# Altium project Fastino.PrjPCB (part 5 of 6)

## Sheet Fastino_DAC_Series_Termination.SchDoc: Fastino
size 420 x 297 mm; Author: G.Kasprowicz; CompanyName: WUT ISE; DrawnBy: G.Kasprowicz; Organization: WUT ISE; Address1: PW ISE; Address2: Nowowiejska 15/19 00-665 Warsaw; Address3: gkasprow@gmail.com; Revision: 2; SheetNumber: 9; SheetTotal: 12; ModifiedBy: -; CheckedDate: -; Title2: Series termination; DivGrp: WUT ISE; Designer: G.Kasprowicz; ModifiedDate: -; ProjectName: Sensor Box
Used 32 times, as channels DAC_Series_Termination1, DAC_Series_Termination2, DAC_Series_Termination3, DAC_Series_Termination4, DAC_Series_Termination5, DAC_Series_Termination6, DAC_Series_Termination7, DAC_Series_Termination8, DAC_Series_Termination9, DAC_Series_Termination10, DAC_Series_Termination11, DAC_Series_Termination12, DAC_Series_Termination13, DAC_Series_Termination14, DAC_Series_Termination15, DAC_Series_Termination16, DAC_Series_Termination17, DAC_Series_Termination18, DAC_Series_Termination19, DAC_Series_Termination20, DAC_Series_Termination21, DAC_Series_Termination22, DAC_Series_Termination23, DAC_Series_Termination24, DAC_Series_Termination25, DAC_Series_Termination26, DAC_Series_Termination27, DAC_Series_Termination28, DAC_Series_Termination29, DAC_Series_Termination30, DAC_Series_Termination31, DAC_Series_Termination32. Parts and nets are listed once, with the designators drawn on the sheet.
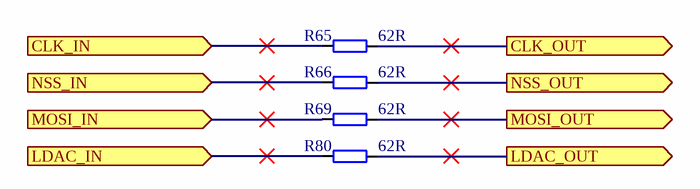
[diagram p8: Fastino_DAC_Series_Termination.SchDoc]

### Parts
R65  62R  [RESC0603X26N]
R66  62R  [RESC0603X26N]
R69  62R  [RESC0603X26N]
R80  62R  [RESC0603X26N]

### Ports
CLK_IN (in), CLK_OUT (out), LDAC_IN (in), LDAC_OUT (out), MOSI_IN (in), MOSI_OUT (out), NSS_IN (in), NSS_OUT (out)

### Nets
CLK_IN: R65.1 ; port CLK_IN
CLK_OUT: R65.2 ; port CLK_OUT
LDAC_IN: R80.1 ; port LDAC_IN
LDAC_OUT: R80.2 ; port LDAC_OUT
MOSI_IN: R69.1 ; port MOSI_IN
MOSI_OUT: R69.2 ; port MOSI_OUT
NSS_IN: R66.1 ; port NSS_IN
NSS_OUT: R66.2 ; port NSS_OUT

### Channels
DAC_Series_Termination1: designators end in _1; ports CLK_IN=DAC_SPI_CLK1 CLK_OUT=DAC_CLK1 LDAC_IN=DAC_SPI_LDACn1 LDAC_OUT=DAC_LDACn1 MOSI_IN=DAC_SPI_SDI1 MOSI_OUT=DAC_MOSI1 NSS_IN=DAC_SPI_NSS1 NSS_OUT=DAC_NSS1
DAC_Series_Termination2: designators end in _2; ports CLK_IN=DAC_SPI_CLK2 CLK_OUT=DAC_CLK2 LDAC_IN=DAC_SPI_LDACn2 LDAC_OUT=DAC_LDACn2 MOSI_IN=DAC_SPI_SDI2 MOSI_OUT=DAC_MOSI2 NSS_IN=DAC_SPI_NSS2 NSS_OUT=DAC_NSS2
DAC_Series_Termination3: designators end in _3; ports CLK_IN=DAC_SPI_CLK3 CLK_OUT=DAC_CLK3 LDAC_IN=DAC_SPI_LDACn3 LDAC_OUT=DAC_LDACn3 MOSI_IN=DAC_SPI_SDI3 MOSI_OUT=DAC_MOSI3 NSS_IN=DAC_SPI_NSS3 NSS_OUT=DAC_NSS3
DAC_Series_Termination4: designators end in _4; ports CLK_IN=DAC_SPI_CLK4 CLK_OUT=DAC_CLK4 LDAC_IN=DAC_SPI_LDACn4 LDAC_OUT=DAC_LDACn4 MOSI_IN=DAC_SPI_SDI4 MOSI_OUT=DAC_MOSI4 NSS_IN=DAC_SPI_NSS4 NSS_OUT=DAC_NSS4
DAC_Series_Termination5: designators end in _5; ports CLK_IN=DAC_SPI_CLK5 CLK_OUT=DAC_CLK5 LDAC_IN=DAC_SPI_LDACn5 LDAC_OUT=DAC_LDACn5 MOSI_IN=DAC_SPI_SDI5 MOSI_OUT=DAC_MOSI5 NSS_IN=DAC_SPI_NSS5 NSS_OUT=DAC_NSS5
DAC_Series_Termination6: designators end in _6; ports CLK_IN=DAC_SPI_CLK6 CLK_OUT=DAC_CLK6 LDAC_IN=DAC_SPI_LDACn6 LDAC_OUT=DAC_LDACn6 MOSI_IN=DAC_SPI_SDI6 MOSI_OUT=DAC_MOSI6 NSS_IN=DAC_SPI_NSS6 NSS_OUT=DAC_NSS6
DAC_Series_Termination7: designators end in _7; ports CLK_IN=DAC_SPI_CLK7 CLK_OUT=DAC_CLK7 LDAC_IN=DAC_SPI_LDACn7 LDAC_OUT=DAC_LDACn7 MOSI_IN=DAC_SPI_SDI7 MOSI_OUT=DAC_MOSI7 NSS_IN=DAC_SPI_NSS7 NSS_OUT=DAC_NSS7
DAC_Series_Termination8: designators end in _8; ports CLK_IN=DAC_SPI_CLK8 CLK_OUT=DAC_CLK8 LDAC_IN=DAC_SPI_LDACn8 LDAC_OUT=DAC_LDACn8 MOSI_IN=DAC_SPI_SDI8 MOSI_OUT=DAC_MOSI8 NSS_IN=DAC_SPI_NSS8 NSS_OUT=DAC_NSS8
DAC_Series_Termination9: designators end in _9; ports CLK_IN=DAC_SPI_CLK9 CLK_OUT=DAC_CLK9 LDAC_IN=DAC_SPI_LDACn9 LDAC_OUT=DAC_LDACn9 MOSI_IN=DAC_SPI_SDI9 MOSI_OUT=DAC_MOSI9 NSS_IN=DAC_SPI_NSS9 NSS_OUT=DAC_NSS9
DAC_Series_Termination10: designators end in _10; ports CLK_IN=DAC_SPI_CLK10 CLK_OUT=DAC_CLK10 LDAC_IN=DAC_SPI_LDACn10 LDAC_OUT=DAC_LDACn10 MOSI_IN=DAC_SPI_SDI10 MOSI_OUT=DAC_MOSI10 NSS_IN=DAC_SPI_NSS10 NSS_OUT=DAC_NSS10
DAC_Series_Termination11: designators end in _11; ports CLK_IN=DAC_SPI_CLK11 CLK_OUT=DAC_CLK11 LDAC_IN=DAC_SPI_LDACn11 LDAC_OUT=DAC_LDACn11 MOSI_IN=DAC_SPI_SDI11 MOSI_OUT=DAC_MOSI11 NSS_IN=DAC_SPI_NSS11 NSS_OUT=DAC_NSS11
DAC_Series_Termination12: designators end in _12; ports CLK_IN=DAC_SPI_CLK12 CLK_OUT=DAC_CLK12 LDAC_IN=DAC_SPI_LDACn12 LDAC_OUT=DAC_LDACn12 MOSI_IN=DAC_SPI_SDI12 MOSI_OUT=DAC_MOSI12 NSS_IN=DAC_SPI_NSS12 NSS_OUT=DAC_NSS12
DAC_Series_Termination13: designators end in _13; ports CLK_IN=DAC_SPI_CLK13 CLK_OUT=DAC_CLK13 LDAC_IN=DAC_SPI_LDACn13 LDAC_OUT=DAC_LDACn13 MOSI_IN=DAC_SPI_SDI13 MOSI_OUT=DAC_MOSI13 NSS_IN=DAC_SPI_NSS13 NSS_OUT=DAC_NSS13
DAC_Series_Termination14: designators end in _14; ports CLK_IN=DAC_SPI_CLK14 CLK_OUT=DAC_CLK14 LDAC_IN=DAC_SPI_LDACn14 LDAC_OUT=DAC_LDACn14 MOSI_IN=DAC_SPI_SDI14 MOSI_OUT=DAC_MOSI14 NSS_IN=DAC_SPI_NSS14 NSS_OUT=DAC_NSS14
DAC_Series_Termination15: designators end in _15; ports CLK_IN=DAC_SPI_CLK15 CLK_OUT=DAC_CLK15 LDAC_IN=DAC_SPI_LDACn15 LDAC_OUT=DAC_LDACn15 MOSI_IN=DAC_SPI_SDI15 MOSI_OUT=DAC_MOSI15 NSS_IN=DAC_SPI_NSS15 NSS_OUT=DAC_NSS15
DAC_Series_Termination16: designators end in _16; ports CLK_IN=DAC_SPI_CLK16 CLK_OUT=DAC_CLK16 LDAC_IN=DAC_SPI_LDACn16 LDAC_OUT=DAC_LDACn16 MOSI_IN=DAC_SPI_SDI16 MOSI_OUT=DAC_MOSI16 NSS_IN=DAC_SPI_NSS16 NSS_OUT=DAC_NSS16
DAC_Series_Termination17: designators end in _17; ports CLK_IN=DAC_SPI_CLK17 CLK_OUT=DAC_CLK17 LDAC_IN=DAC_SPI_LDACn17 LDAC_OUT=DAC_LDACn17 MOSI_IN=DAC_SPI_SDI17 MOSI_OUT=DAC_MOSI17 NSS_IN=DAC_SPI_NSS17 NSS_OUT=DAC_NSS17
DAC_Series_Termination18: designators end in _18; ports CLK_IN=DAC_SPI_CLK18 CLK_OUT=DAC_CLK18 LDAC_IN=DAC_SPI_LDACn18 LDAC_OUT=DAC_LDACn18 MOSI_IN=DAC_SPI_SDI18 MOSI_OUT=DAC_MOSI18 NSS_IN=DAC_SPI_NSS18 NSS_OUT=DAC_NSS18
DAC_Series_Termination19: designators end in _19; ports CLK_IN=DAC_SPI_CLK19 CLK_OUT=DAC_CLK19 LDAC_IN=DAC_SPI_LDACn19 LDAC_OUT=DAC_LDACn19 MOSI_IN=DAC_SPI_SDI19 MOSI_OUT=DAC_MOSI19 NSS_IN=DAC_SPI_NSS19 NSS_OUT=DAC_NSS19
DAC_Series_Termination20: designators end in _20; ports CLK_IN=DAC_SPI_CLK20 CLK_OUT=DAC_CLK20 LDAC_IN=DAC_SPI_LDACn20 LDAC_OUT=DAC_LDACn20 MOSI_IN=DAC_SPI_SDI20 MOSI_OUT=DAC_MOSI20 NSS_IN=DAC_SPI_NSS20 NSS_OUT=DAC_NSS20
DAC_Series_Termination21: designators end in _21; ports CLK_IN=DAC_SPI_CLK21 CLK_OUT=DAC_CLK21 LDAC_IN=DAC_SPI_LDACn21 LDAC_OUT=DAC_LDACn21 MOSI_IN=DAC_SPI_SDI21 MOSI_OUT=DAC_MOSI21 NSS_IN=DAC_SPI_NSS21 NSS_OUT=DAC_NSS21
DAC_Series_Termination22: designators end in _22; ports CLK_IN=DAC_SPI_CLK22 CLK_OUT=DAC_CLK22 LDAC_IN=DAC_SPI_LDACn22 LDAC_OUT=DAC_LDACn22 MOSI_IN=DAC_SPI_SDI22 MOSI_OUT=DAC_MOSI22 NSS_IN=DAC_SPI_NSS22 NSS_OUT=DAC_NSS22
DAC_Series_Termination23: designators end in _23; ports CLK_IN=DAC_SPI_CLK23 CLK_OUT=DAC_CLK23 LDAC_IN=DAC_SPI_LDACn23 LDAC_OUT=DAC_LDACn23 MOSI_IN=DAC_SPI_SDI23 MOSI_OUT=DAC_MOSI23 NSS_IN=DAC_SPI_NSS23 NSS_OUT=DAC_NSS23
DAC_Series_Termination24: designators end in _24; ports CLK_IN=DAC_SPI_CLK24 CLK_OUT=DAC_CLK24 LDAC_IN=DAC_SPI_LDACn24 LDAC_OUT=DAC_LDACn24 MOSI_IN=DAC_SPI_SDI24 MOSI_OUT=DAC_MOSI24 NSS_IN=DAC_SPI_NSS24 NSS_OUT=DAC_NSS24
DAC_Series_Termination25: designators end in _25; ports CLK_IN=DAC_SPI_CLK25 CLK_OUT=DAC_CLK25 LDAC_IN=DAC_SPI_LDACn25 LDAC_OUT=DAC_LDACn25 MOSI_IN=DAC_SPI_SDI25 MOSI_OUT=DAC_MOSI25 NSS_IN=DAC_SPI_NSS25 NSS_OUT=DAC_NSS25
DAC_Series_Termination26: designators end in _26; ports CLK_IN=DAC_SPI_CLK26 CLK_OUT=DAC_CLK26 LDAC_IN=DAC_SPI_LDACn26 LDAC_OUT=DAC_LDACn26 MOSI_IN=DAC_SPI_SDI26 MOSI_OUT=DAC_MOSI26 NSS_IN=DAC_SPI_NSS26 NSS_OUT=DAC_NSS26
DAC_Series_Termination27: designators end in _27; ports CLK_IN=DAC_SPI_CLK27 CLK_OUT=DAC_CLK27 LDAC_IN=DAC_SPI_LDACn27 LDAC_OUT=DAC_LDACn27 MOSI_IN=DAC_SPI_SDI27 MOSI_OUT=DAC_MOSI27 NSS_IN=DAC_SPI_NSS27 NSS_OUT=DAC_NSS27
DAC_Series_Termination28: designators end in _28; ports CLK_IN=DAC_SPI_CLK28 CLK_OUT=DAC_CLK28 LDAC_IN=DAC_SPI_LDACn28 LDAC_OUT=DAC_LDACn28 MOSI_IN=DAC_SPI_SDI28 MOSI_OUT=DAC_MOSI28 NSS_IN=DAC_SPI_NSS28 NSS_OUT=DAC_NSS28
DAC_Series_Termination29: designators end in _29; ports CLK_IN=DAC_SPI_CLK29 CLK_OUT=DAC_CLK29 LDAC_IN=DAC_SPI_LDACn29 LDAC_OUT=DAC_LDACn29 MOSI_IN=DAC_SPI_SDI29 MOSI_OUT=DAC_MOSI29 NSS_IN=DAC_SPI_NSS29 NSS_OUT=DAC_NSS29
DAC_Series_Termination30: designators end in _30; ports CLK_IN=DAC_SPI_CLK30 CLK_OUT=DAC_CLK30 LDAC_IN=DAC_SPI_LDACn30 LDAC_OUT=DAC_LDACn30 MOSI_IN=DAC_SPI_SDI30 MOSI_OUT=DAC_MOSI30 NSS_IN=DAC_SPI_NSS30 NSS_OUT=DAC_NSS30
DAC_Series_Termination31: designators end in _31; ports CLK_IN=DAC_SPI_CLK31 CLK_OUT=DAC_CLK31 LDAC_IN=DAC_SPI_LDACn31 LDAC_OUT=DAC_LDACn31 MOSI_IN=DAC_SPI_SDI31 MOSI_OUT=DAC_MOSI31 NSS_IN=DAC_SPI_NSS31 NSS_OUT=DAC_NSS31
DAC_Series_Termination32: designators end in _32; ports CLK_IN=DAC_SPI_CLK32 CLK_OUT=DAC_CLK32 LDAC_IN=DAC_SPI_LDACn32 LDAC_OUT=DAC_LDACn32 MOSI_IN=DAC_SPI_SDI32 MOSI_OUT=DAC_MOSI32 NSS_IN=DAC_SPI_NSS32 NSS_OUT=DAC_NSS32

### Notes on the sheet
- Project/Equipment
- Document
- Designer
- Drawn by
- Check.by
- Copyright WUT ISE 2024.
  This documentation describes Open Hardware and is licensed under the CERN OHL v.2. You may redistribute and modify this documentation under the terms of the CERN OHL v.2. (http://ohwr.org/CERNOHL). This documentation is distributed WITHOUT ANY EXPRESS OR IMPLIED WARRANTY, INCLUDING OF MERCHANTABILITY, SATISFACTORY QUALITY AND FITNESS FOR A PARTICULAR PURPOSE. Please see the CERN OHL v.2 for applicable conditions.
- Contact
- File
- Last Mod.
- Print Date
- Sheet
- Size
- A3
- of
- Rev

### Library data of the parts
R65 R66 R69 R80 = R0201_62R_1%_0.05W_200PPM: Resistor - 1%; Manufacturer: GENERIC; Manufacturer1 Part Number: ERJ-1GNF62R0C; Part Description: Thick Film Chip Resistor; Power: 0.05W; TC: ±200ppm/°C; PressFit: No; Part Number: R0201_62R_1%_0.05W_200PPM; Manufacturer Part Number: R0201_62R_1%_0.05W_200PPM; Value: 62R; Tolerance: ±1%; Case: 0201; Component Type: Standard; Manufacturer1 ComponentHeight: 0.23mm; Manufacturer1 Example: Panasonic; Mounted: Yes; Component Kind: Standard; Pin Count: 2; Status: None; Sense: No; Socket: No; SMD: Yes; ComponentHeight: 0.27mm; HelpURL: \\cern.ch\dfs\Applications\Altium\Datasheets\R0201_VISHAY_TNPR e3.pdf; Author: CERN DEM HF; CreateDate: 27.08.2024; LatestRevisionDate: 27.08.2024